# EAGLE design ECHO (EAGLE 6.5.0)
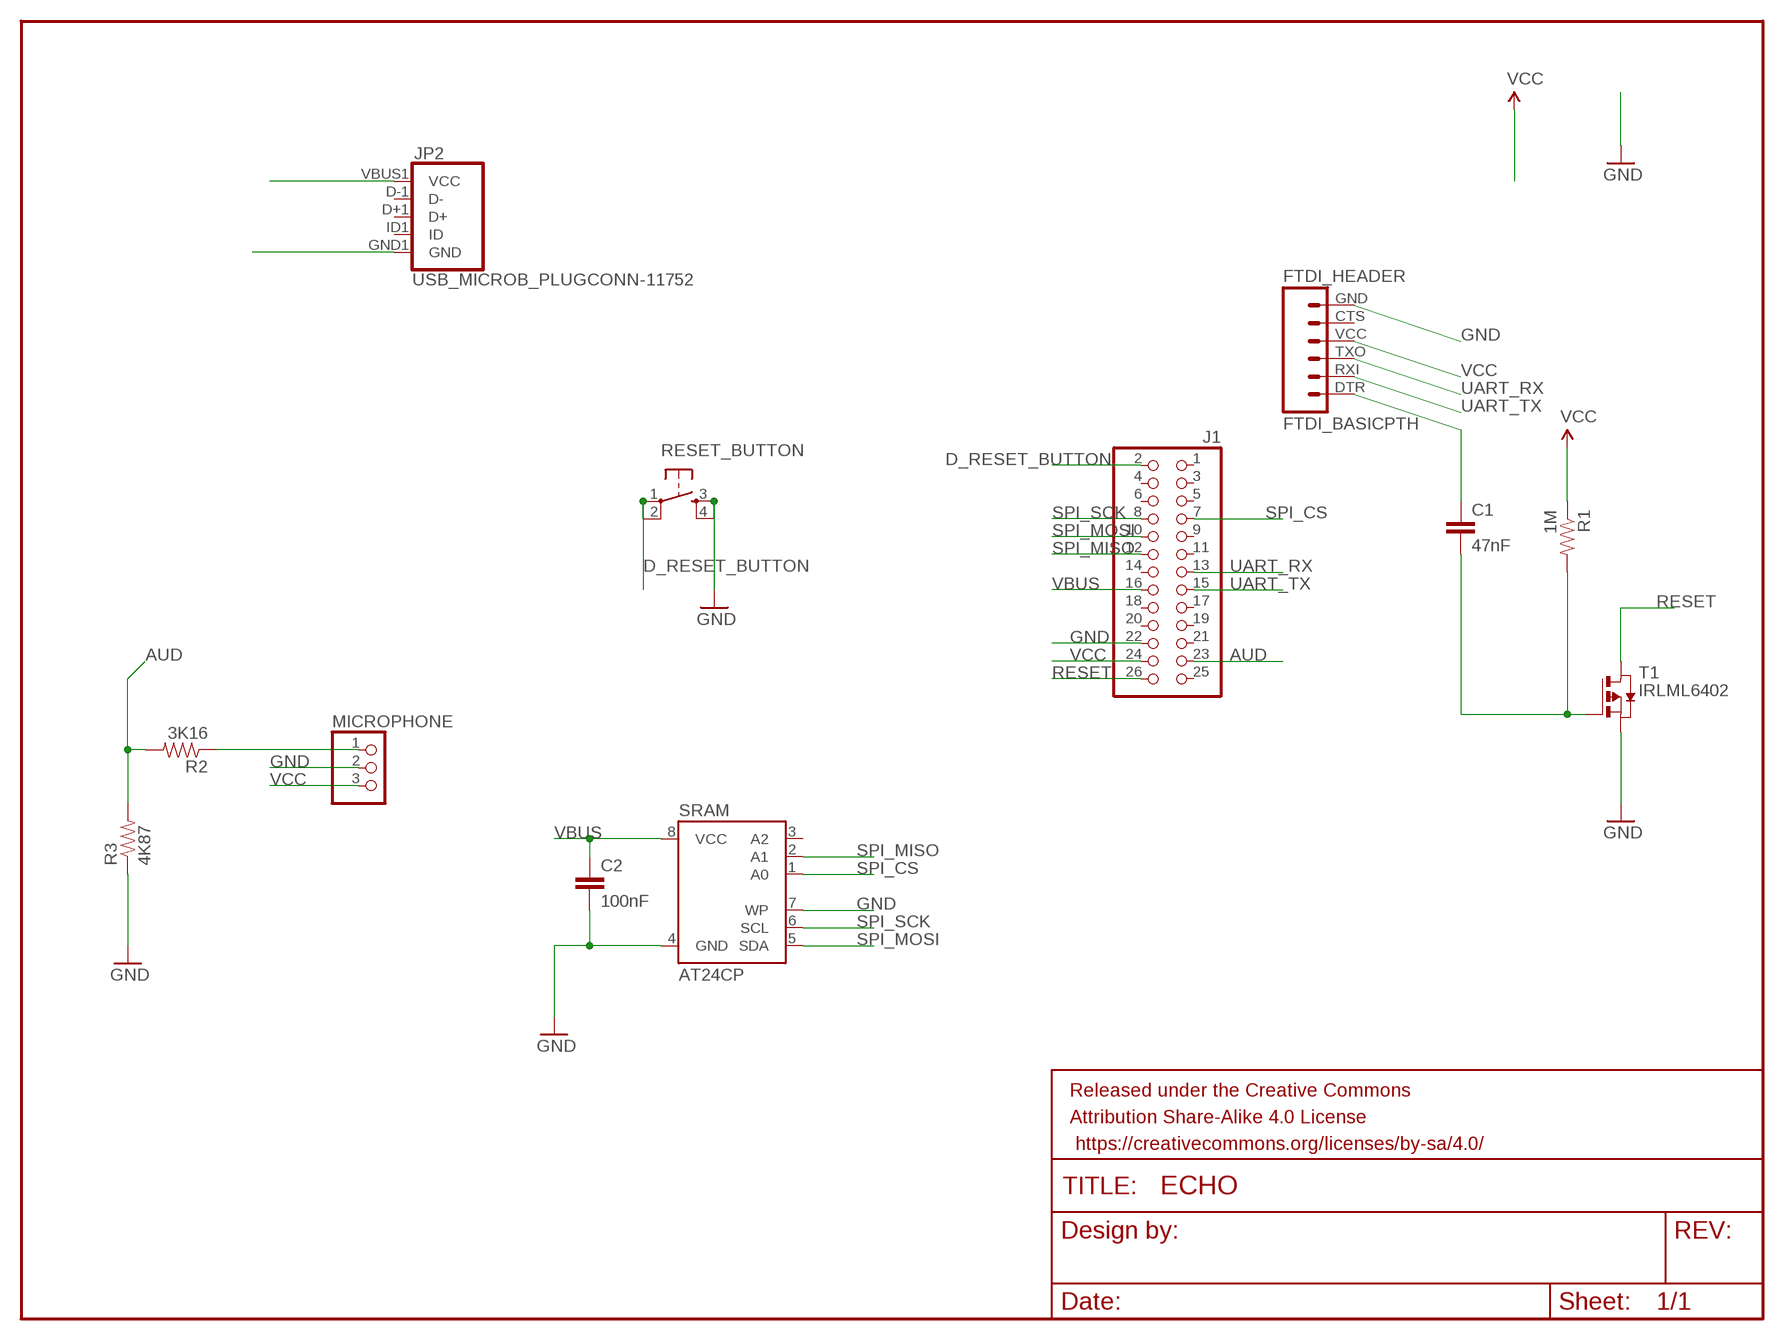
[diagram p0: schematic, sheet 1]

## Parts
C1  47nF  47NF(0.047UF/47000PF)-25V-5%(0603)SMD  [0603-CAP]
C2  100nF  10NF/10000PF-50V-10%(0603)  [0603-CAP]
FRAME1  FRAME-LETTER  [CREATIVE_COMMONS]
FTDI_HEADER  FTDI_BASICPTH  [FTDI_BASIC]
J1  PINHD-2X13  [2X13]
JP2  USB_MICROB_PLUGCONN-11752  [USB-B-MICRO-SMD_V03]
MICROPHONE  PINHD-1X3  [1X03]
R1  1M  1MOHM1/10W1%(0603)  [0603-RES]
R2  3K16  1OHM1/10W1%(0603)  [0603-RES]
R3  4K87  1OHM1/10W1%(0603)  [0603-RES]
RESET_BUTTON  TAC_SWITCHSMD  [TACTILE-SWITCH-SMD]
SRAM  AT24CP  [DIL08]
T1  IRLML6402  [SOT-23]

## Nets
AUD: J1.23 R2.2 R3.2
D_RESET_BUTTON: J1.2 RESET_BUTTON.1 RESET_BUTTON.2
GND: C2.2 FTDI_HEADER.GND J1.22 JP2.GND1(GND) MICROPHONE.2 R3.1 RESET_BUTTON.3 RESET_BUTTON.4 SRAM.4(GND) SRAM.7(WP) T1.2(S)
N$1: C1.1 FTDI_HEADER.DTR
N$2: C1.2 R1.2 T1.1(G)
N$3: MICROPHONE.1 R2.1
RESET: J1.26 T1.3(D)
SPI_CS: J1.7 SRAM.1(A0)
SPI_MISO: J1.12 SRAM.2(A1)
SPI_MOSI: J1.10 SRAM.5(SDA)
SPI_SCK: J1.8 SRAM.6(SCL)
UART_RX: FTDI_HEADER.TXO J1.13
UART_TX: FTDI_HEADER.RXI J1.15
VBUS: C2.1 J1.16 JP2.VBUS1(VCC) SRAM.8(VCC)
VCC: FTDI_HEADER.VCC J1.24 MICROPHONE.3 R1.1
Unconnected: FTDI_HEADER.CTS J1.1 J1.3 J1.4 J1.5 J1.6 J1.9 J1.11 J1.14 J1.17 J1.18 J1.19 J1.20 J1.21 J1.25 JP2.D+1(D+) JP2.D-1(D-) JP2.ID1(ID) SRAM.3(A2)

## Library data of the parts
C1 = SparkFun-Capacitors:47NF(0.047UF/47000PF)-25V-5%(0603): CAP-08605; PROD_ID: CAP-08605
C2 = SparkFun-Capacitors:10NF/10000PF-50V-10%(0603): CAP-00867; PROD_ID: CAP-00867; VALUE: 10nF
FRAME1 = SparkFun-Aesthetics:FRAME-LETTER: Schematic Frame Standard 8.5x11 US Letter frame
FTDI_HEADER = SparkFun-Connectors:FTDI_BASIC: FTDI Basic header with labels
J1 = pinhead:PINHD-2X13: PIN HEADER
JP2 = SparkFun-Connectors:USB_MICROB_PLUG: USB Micro-B connectors Some male, some female. Watch your step!; PROD_ID: CONN-11752
MICROPHONE = pinhead:PINHD-1X3: PIN HEADER
R1 = SparkFun-Resistors:1MOHM1/10W1%(0603): RES-07868; PROD_ID: RES-07868
R2 R3 = SparkFun-Resistors:1OHM1/10W1%(0603): RES-08269; PROD_ID: RES-08269; VALUE: 1
RESET_BUTTON = SparkFun-Electromechanical:TAC_SWITCH: Momentary Switch Button commonly used for reset or general input. Spark Fun Electronics SKU : COM-00097 SMT- SWCH-08247
SRAM = atmel:AT24C*: 2-wire serial EEPROM; MPN: AT24C1024BW-SH-B; OC_FARNELL: 1362646; OC_NEWARK: 03P2044
T1 = IRLML6402:IRLML6402

## Board
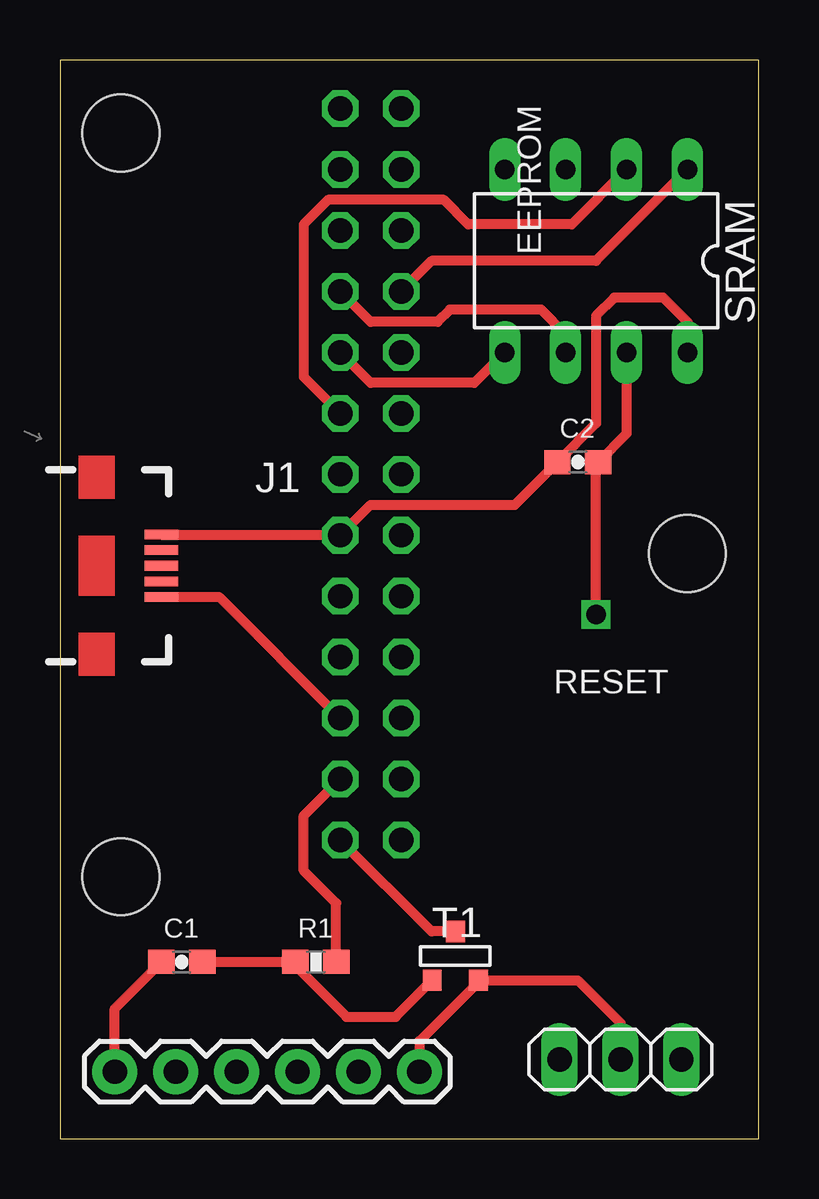
[diagram p1: board, top side]
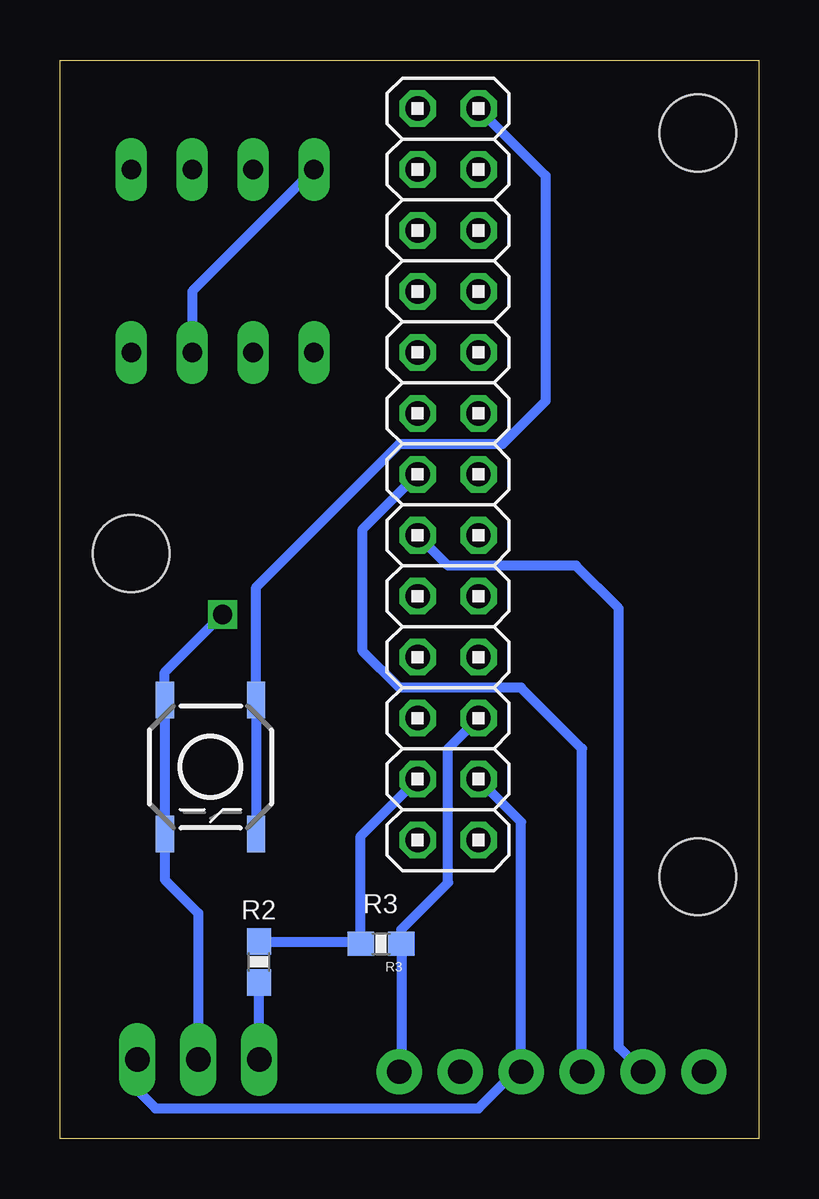
[diagram p2: board, bottom side, seen from below]

Size 29.13 x 44.95 mm. Coordinates in mm from the lower left corner, seen from the top.
Outline: 0,0 29.13,0 29.13,44.95 0,44.95 0,0
Copper layers (1*16): Top 0.035mm / dielectric 1.5mm / Bottom 0.035mm
Design rules "advanced": minimum track width 8mil, minimum drill 10mil, track to track 8mil, track to pad 8mil, pad to pad 8mil, via to via 8mil, smd to smd 8mil, copper to edge 10mil, drill to drill 8mil, minimum pad ring 10mil, minimum via ring 8mil, stop-mask expansion 4mil, vias tented up to drill 0mil, thermal gap 10mil
Holes 3.2 mm at 2.54,41.91 26.16,24.38 2.54,10.92

### Footprints (pad centres in the part's own frame; a part is rotated, then mirrored left to right if it is on the bottom)
0603-CAP = smd 1.1 x 1: 1 -0.85,0; 2 0.85,0
FTDI_BASIC = drill 1.016 pad 1.88: CTS 10.16,0; DTR 0,0; GND 12.7,0; RXI 2.54,0; TXO 5.08,0; VCC 7.62,0
2X13 = drill 1.016 octagon: 1 -15.24,-1.27; 2 -15.24,1.27; 3 -12.7,-1.27; 4 -12.7,1.27; 5 -10.16,-1.27; 6 -10.16,1.27; 7 -7.62,-1.27; 8 -7.62,1.27; 9 -5.08,-1.27; 10 -5.08,1.27; 11 -2.54,-1.27; 12 -2.54,1.27; 13 0,-1.27; 14 0,1.27; 15 2.54,-1.27; 16 2.54,1.27; 17 5.08,-1.27; 18 5.08,1.27; 19 7.62,-1.27; 20 7.62,1.27; 21 10.16,-1.27; 22 10.16,1.27; 23 12.7,-1.27; 24 12.7,1.27; 25 15.24,-1.27; 26 15.24,1.27
USB-B-MICRO-SMD_V03 = smd 1.4 x 0.4: D+1 2.7,0; D-1 2.7,0.65; GND1 2.7,-1.3; ID1 2.7,-0.65; VBUS1 2.7,1.3
1X03 = drill 1.016 long: 1 -2.54,0; 2 0,0; 3 2.54,0
0603-RES = smd 1.1 x 1: 1 -0.85,0; 2 0.85,0
TACTILE-SWITCH-SMD = smd 1.524 x 0.762: 1 -2.794,1.905; 2 2.794,1.905; 3 -2.794,-1.905; 4 2.794,-1.905
DIL08 = drill 0.813 long: 1 -3.81,-3.81; 2 -1.27,-3.81; 3 1.27,-3.81; 4 3.81,-3.81; 5 3.81,3.81; 6 1.27,3.81; 7 -1.27,3.81; 8 -3.81,3.81
SOT-23 = smd 0.787 x 0.889: 1 0.991,1.016; 2 -0.94,1.016; 3 0.025,-1.016

### Placement (x,y rotation side)
C1  5.08,7.37 0 top
C2  21.59,28.19 0 top
FRAME1  -77.47,12.7 0 top  (outside the outline)
FTDI_HEADER  2.29,2.79 0 top
J1  12.95,27.69 270 bottom
JP2  1.52,23.88 0 top
MICROPHONE  23.37,3.3 0 top
R1  10.67,7.37 180 top
R2  20.83,7.37 90 bottom
R3  15.75,8.13 180 bottom
RESET_BUTTON  22.86,15.49 270 bottom
SRAM  22.35,36.58 180 top
T1  16.51,7.62 180 top

### Tracks (layer width: path | path; a pad name or v marks a point on that pad's centre or on a via)
AUD
  Bottom 0.406: J1.23 16.6,12.61 R3.2 16.69,8.22 R2.2
D_RESET_BUTTON
  Bottom 0.406: RESET_BUTTON.2 RESET_BUTTON.1 20.95,22.99 14.99,28.96 10.67,28.96 8.89,30.73 8.89,40.13 J1.2
GND  (via drill 0.8)
  Top 0.406: JP2.GND1 6.63,22.58 J1.22 | 14.99,2.29 FTDI_HEADER.GND 14.99,4.06 17.45,6.53 T1.2 21.59,6.6 23.37,4.83 MICROPHONE.2 | v22.35,21.84 22.35,28.11 C2.2 23.62,29.38 SRAM.7
  Bottom 0.406: FTDI_HEADER.GND 14.9,2.88 R3.1 14.9,8.72 12.95,10.67 12.95,16.26 J1.22 | v22.35,21.84 24.77,19.43 RESET_BUTTON.3 RESET_BUTTON.4 24.77,10.79 23.37,9.4 MICROPHONE.2 | SRAM.4 23.62,35.31 SRAM.7
N$1
  Top 0.406: FTDI_HEADER.DTR 2.29,5.42 C1.1
N$2
  Top 0.406: C1.2 R1.2 9.82,7.2 11.94,5.08 13.99,5.08 T1.1
N$3
  Bottom 0.406: MICROPHONE.1 R2.1
RESET
  Top 0.406: T1.3 15.49,8.64 J1.26
SPI_CS
  Top 0.406: SRAM.1 22.35,36.58 15.49,36.58 J1.7
SPI_MISO
  Top 0.406: SRAM.2 21.34,38.1 17.02,38.1 16,39.12 11.18,39.12 10.16,38.1 10.16,31.75 J1.12
SPI_MOSI
  Top 0.406: SRAM.5 17.27,31.5 12.95,31.5 J1.10
SPI_SCK
  Top 0.406: SRAM.6 21.08,33.53 20.07,34.54 16.26,34.54 15.75,34.04 12.95,34.04 J1.8
UART_RX
  Bottom 0.406: FTDI_HEADER.TXO 7.37,16.26 9.91,18.8 14.99,18.8 16.51,20.32 16.51,25.4 J1.13
UART_TX
  Bottom 0.406: FTDI_HEADER.RXI 5.84,3.81 5.84,22.1 7.62,23.88 12.95,23.88 J1.15
VBUS
  Top 0.406: JP2.VBUS1 11.65,25.18 J1.16 12.95,26.42 18.96,26.42 C2.1 22.35,29.81 22.35,34.29 23.11,35.05 25.15,35.05 26.16,34.04 SRAM.8
VCC
  Top 0.406: R1.1 11.52,9.82 10.16,11.18 10.16,13.46 J1.24
  Bottom 0.406: J1.24 9.91,13.21 FTDI_HEADER.VCC 10.16,2.79 11.68,1.27 25.15,1.27 25.91,2.03 MICROPHONE.3

### Text on the board
tNames: EEPROM | C2 | J1 | RESET | C1 | R1 | T1
bNames: R3 | R2
tValues: 2 | 1 | 1 | 100nF | 26 | 25 | 47nF | 1M | DTR | RXI | TXO | VCC | CTS | GND | GND | AUD | VCC
bValues: 4K87 | 3K16
bDocu: CSE 477: Team 4 / Project: Echo / Version: 1.0